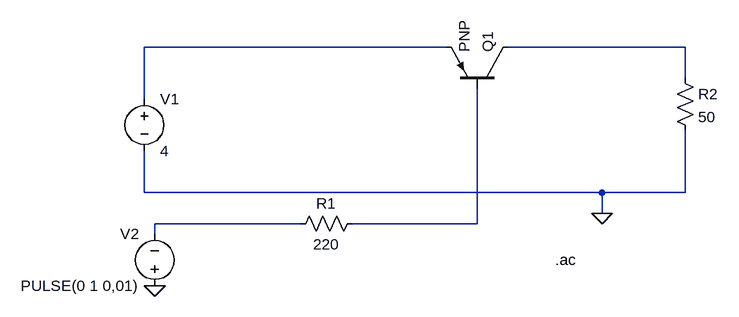
[diagram p0: schematic taladro.asc]
taladro.asc, the LTspice schematic file:
Version 4
SHEET 1 1144 680
WIRE 496 192 32 192
WIRE 864 192 592 192
WIRE 864 240 864 192
WIRE 32 272 32 192
WIRE 32 416 32 352
WIRE 736 416 32 416
WIRE 864 416 864 320
WIRE 864 416 736 416
WIRE 736 448 736 416
WIRE 272 464 48 464
WIRE 544 464 544 256
WIRE 544 464 352 464
WIRE 48 480 48 464
FLAG 48 560 0
FLAG 736 448 0
SYMBOL voltage 32 256 R0
SYMATTR InstName V1
SYMATTR Value 4
SYMBOL res 368 448 R90
WINDOW 0 0 56 VBottom 2
WINDOW 3 32 56 VTop 2
SYMATTR InstName R1
SYMATTR Value 220
SYMBOL res 848 224 R0
SYMATTR InstName R2
SYMATTR Value 50
SYMBOL voltage 48 576 R180
WINDOW 0 24 96 Left 2
WINDOW 3 24 16 Left 2
SYMATTR InstName V2
SYMATTR Value PULSE(0 1 0,01)
SYMBOL pnp 592 256 M270
SYMATTR InstName Q1
TEXT 664 520 Left 2 !.ac

The netlist it stands for:
* taladro.asc
V1 N001 0 4
R1 N004 N003 220
R2 N002 0 50
V2 0 N003 PULSE(0 1 0,01)
Q1 N002 N004 N001 0 PNP
.model NPN NPN
.model PNP PNP
.lib standard.bjt
.ac
.backanno
.end